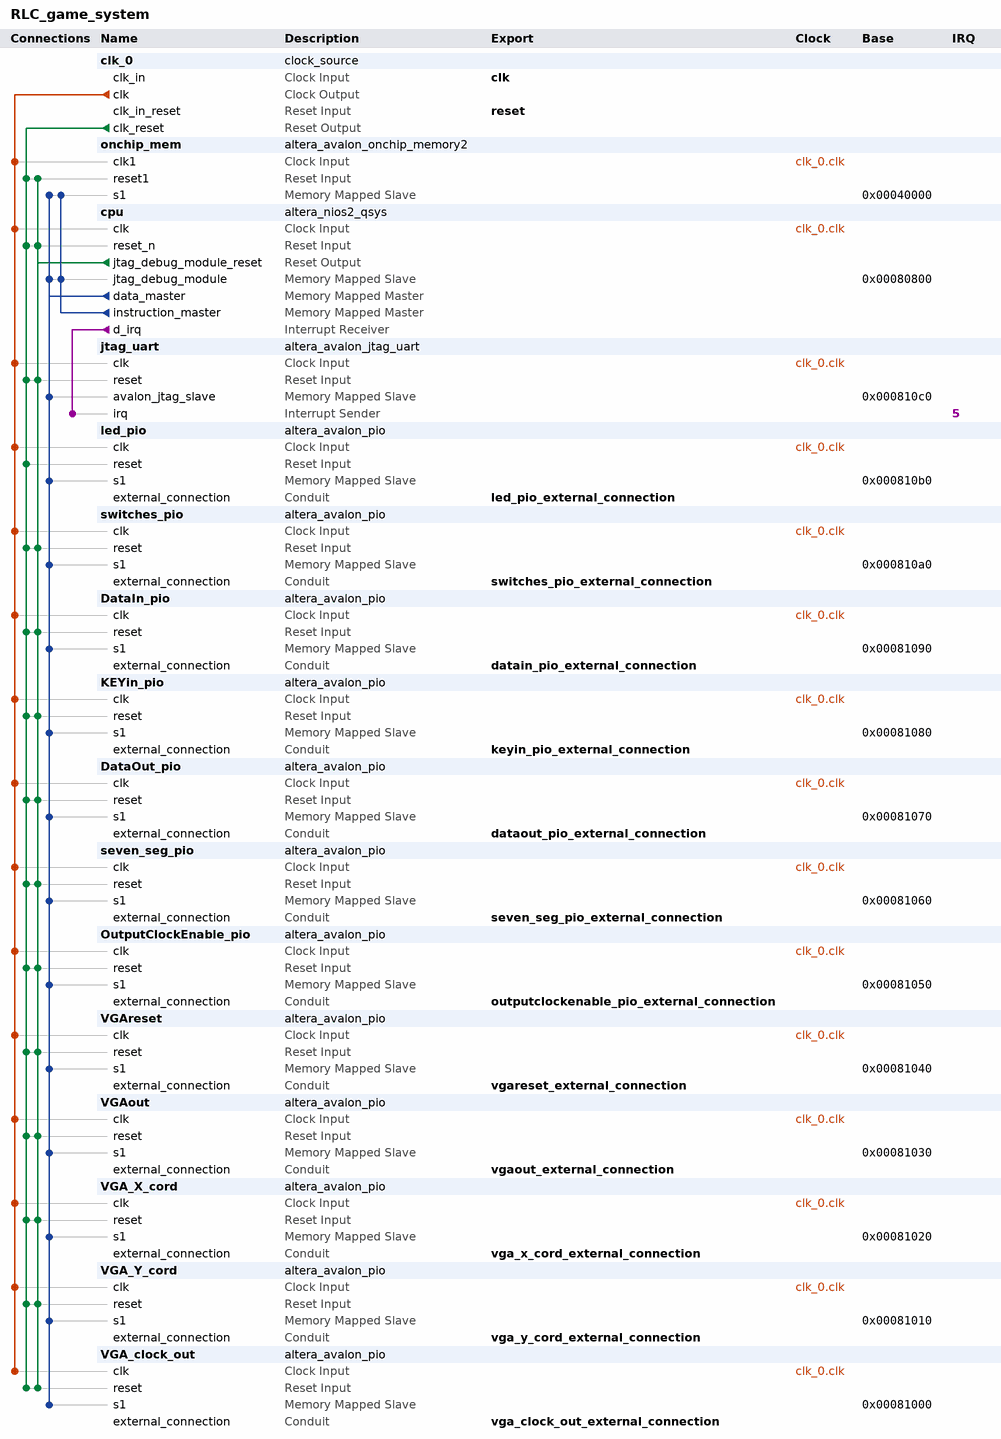
[diagram p0: system contents]
# Platform Designer (Qsys) system RLC_game_system, Cyclone V 5CSEMA5F31C6
# Parameters at their usual value, and those the tool derives, are not listed.
package require -exact qsys 14.0
create_system RLC_game_system
set_project_property DEVICE_FAMILY {Cyclone V}
set_project_property DEVICE 5CSEMA5F31C6

add_instance clk_0 clock_source 14.0
set_instance_parameter_value clk_0 clockFrequency 50000000

add_instance onchip_mem altera_avalon_onchip_memory2 14.0
set_instance_parameter_value onchip_mem dataWidth 32
set_instance_parameter_value onchip_mem dualPort false
set_instance_parameter_value onchip_mem initMemContent true
set_instance_parameter_value onchip_mem initializationFileName onchip_mem.hex
set_instance_parameter_value onchip_mem memorySize 200000

add_instance cpu altera_nios2_qsys 14.0
set_instance_parameter_value cpu resetrequest_enabled true
set_instance_parameter_value cpu resetSlave onchip_mem.s1
set_instance_parameter_value cpu mmu_TLBMissExcSlave None
set_instance_parameter_value cpu exceptionSlave onchip_mem.s1
set_instance_parameter_value cpu breakSlave cpu.jtag_debug_module
set_instance_parameter_value cpu muldiv_multiplierType NoneSmall
set_instance_parameter_value cpu impl Tiny
set_instance_parameter_value cpu icache_size 2048

add_instance jtag_uart altera_avalon_jtag_uart 14.0
set_instance_parameter_value jtag_uart simInteractiveOptions NO_INTERACTIVE_WINDOWS

add_instance led_pio altera_avalon_pio 14.0
set_instance_parameter_value led_pio direction Output
set_instance_parameter_value led_pio width 8

add_instance switches_pio altera_avalon_pio 14.0
set_instance_parameter_value switches_pio direction Input
set_instance_parameter_value switches_pio width 8

add_instance DataIn_pio altera_avalon_pio 14.0
set_instance_parameter_value DataIn_pio direction Input
set_instance_parameter_value DataIn_pio width 8

add_instance KEYin_pio altera_avalon_pio 14.0
set_instance_parameter_value KEYin_pio direction Input
set_instance_parameter_value KEYin_pio width 3

add_instance DataOut_pio altera_avalon_pio 14.0
set_instance_parameter_value DataOut_pio direction Output
set_instance_parameter_value DataOut_pio width 8

add_instance seven_seg_pio altera_avalon_pio 14.0
set_instance_parameter_value seven_seg_pio direction Output
set_instance_parameter_value seven_seg_pio width 7

add_instance OutputClockEnable_pio altera_avalon_pio 14.0
set_instance_parameter_value OutputClockEnable_pio direction Output
set_instance_parameter_value OutputClockEnable_pio width 1

add_instance VGAreset altera_avalon_pio 14.0
set_instance_parameter_value VGAreset direction Output
set_instance_parameter_value VGAreset width 1

add_instance VGAout altera_avalon_pio 14.0
set_instance_parameter_value VGAout direction Output
set_instance_parameter_value VGAout width 24

add_instance VGA_X_cord altera_avalon_pio 14.0
set_instance_parameter_value VGA_X_cord direction Input
set_instance_parameter_value VGA_X_cord width 10

add_instance VGA_Y_cord altera_avalon_pio 14.0
set_instance_parameter_value VGA_Y_cord direction Input
set_instance_parameter_value VGA_Y_cord width 9

add_instance VGA_clock_out altera_avalon_pio 14.0
set_instance_parameter_value VGA_clock_out direction Output
set_instance_parameter_value VGA_clock_out width 1

# connections
add_connection clk_0.clk cpu.clk clock
add_connection clk_0.clk DataIn_pio.clk clock
add_connection clk_0.clk DataOut_pio.clk clock
add_connection clk_0.clk jtag_uart.clk clock
add_connection clk_0.clk KEYin_pio.clk clock
add_connection clk_0.clk led_pio.clk clock
add_connection clk_0.clk onchip_mem.clk1 clock
add_connection clk_0.clk OutputClockEnable_pio.clk clock
add_connection clk_0.clk seven_seg_pio.clk clock
add_connection clk_0.clk switches_pio.clk clock
add_connection clk_0.clk VGA_clock_out.clk clock
add_connection clk_0.clk VGA_X_cord.clk clock
add_connection clk_0.clk VGA_Y_cord.clk clock
add_connection clk_0.clk VGAout.clk clock
add_connection clk_0.clk VGAreset.clk clock
add_connection clk_0.clk_reset cpu.reset_n reset
add_connection clk_0.clk_reset DataIn_pio.reset reset
add_connection clk_0.clk_reset DataOut_pio.reset reset
add_connection clk_0.clk_reset jtag_uart.reset reset
add_connection clk_0.clk_reset KEYin_pio.reset reset
add_connection clk_0.clk_reset led_pio.reset reset
add_connection clk_0.clk_reset onchip_mem.reset1 reset
add_connection clk_0.clk_reset OutputClockEnable_pio.reset reset
add_connection clk_0.clk_reset seven_seg_pio.reset reset
add_connection clk_0.clk_reset switches_pio.reset reset
add_connection clk_0.clk_reset VGA_clock_out.reset reset
add_connection clk_0.clk_reset VGA_X_cord.reset reset
add_connection clk_0.clk_reset VGA_Y_cord.reset reset
add_connection clk_0.clk_reset VGAout.reset reset
add_connection clk_0.clk_reset VGAreset.reset reset
add_connection cpu.jtag_debug_module_reset cpu.reset_n reset
add_connection cpu.jtag_debug_module_reset DataIn_pio.reset reset
add_connection cpu.jtag_debug_module_reset DataOut_pio.reset reset
add_connection cpu.jtag_debug_module_reset jtag_uart.reset reset
add_connection cpu.jtag_debug_module_reset KEYin_pio.reset reset
add_connection cpu.jtag_debug_module_reset onchip_mem.reset1 reset
add_connection cpu.jtag_debug_module_reset OutputClockEnable_pio.reset reset
add_connection cpu.jtag_debug_module_reset seven_seg_pio.reset reset
add_connection cpu.jtag_debug_module_reset switches_pio.reset reset
add_connection cpu.jtag_debug_module_reset VGA_clock_out.reset reset
add_connection cpu.jtag_debug_module_reset VGA_X_cord.reset reset
add_connection cpu.jtag_debug_module_reset VGA_Y_cord.reset reset
add_connection cpu.jtag_debug_module_reset VGAout.reset reset
add_connection cpu.jtag_debug_module_reset VGAreset.reset reset
add_connection cpu.data_master cpu.jtag_debug_module avalon
set_connection_parameter_value cpu.data_master/cpu.jtag_debug_module baseAddress 0x00080800
add_connection cpu.data_master DataIn_pio.s1 avalon
set_connection_parameter_value cpu.data_master/DataIn_pio.s1 baseAddress 0x00081090
add_connection cpu.data_master DataOut_pio.s1 avalon
set_connection_parameter_value cpu.data_master/DataOut_pio.s1 baseAddress 0x00081070
add_connection cpu.data_master jtag_uart.avalon_jtag_slave avalon
set_connection_parameter_value cpu.data_master/jtag_uart.avalon_jtag_slave baseAddress 0x000810c0
add_connection cpu.data_master KEYin_pio.s1 avalon
set_connection_parameter_value cpu.data_master/KEYin_pio.s1 baseAddress 0x00081080
add_connection cpu.data_master led_pio.s1 avalon
set_connection_parameter_value cpu.data_master/led_pio.s1 baseAddress 0x000810b0
add_connection cpu.data_master onchip_mem.s1 avalon
set_connection_parameter_value cpu.data_master/onchip_mem.s1 baseAddress 0x00040000
add_connection cpu.data_master OutputClockEnable_pio.s1 avalon
set_connection_parameter_value cpu.data_master/OutputClockEnable_pio.s1 baseAddress 0x00081050
add_connection cpu.data_master seven_seg_pio.s1 avalon
set_connection_parameter_value cpu.data_master/seven_seg_pio.s1 baseAddress 0x00081060
add_connection cpu.data_master switches_pio.s1 avalon
set_connection_parameter_value cpu.data_master/switches_pio.s1 baseAddress 0x000810a0
add_connection cpu.data_master VGA_clock_out.s1 avalon
set_connection_parameter_value cpu.data_master/VGA_clock_out.s1 baseAddress 0x00081000
add_connection cpu.data_master VGA_X_cord.s1 avalon
set_connection_parameter_value cpu.data_master/VGA_X_cord.s1 baseAddress 0x00081020
add_connection cpu.data_master VGA_Y_cord.s1 avalon
set_connection_parameter_value cpu.data_master/VGA_Y_cord.s1 baseAddress 0x00081010
add_connection cpu.data_master VGAout.s1 avalon
set_connection_parameter_value cpu.data_master/VGAout.s1 baseAddress 0x00081030
add_connection cpu.data_master VGAreset.s1 avalon
set_connection_parameter_value cpu.data_master/VGAreset.s1 baseAddress 0x00081040
add_connection cpu.instruction_master cpu.jtag_debug_module avalon
set_connection_parameter_value cpu.instruction_master/cpu.jtag_debug_module baseAddress 0x00080800
add_connection cpu.instruction_master onchip_mem.s1 avalon
set_connection_parameter_value cpu.instruction_master/onchip_mem.s1 baseAddress 0x00040000
add_connection cpu.d_irq jtag_uart.irq interrupt
set_connection_parameter_value cpu.d_irq/jtag_uart.irq irqNumber 5

# exported interfaces
add_interface clk clock sink
set_interface_property clk EXPORT_OF clk_0.clk_in
add_interface led_pio_external_connection conduit end
set_interface_property led_pio_external_connection EXPORT_OF led_pio.external_connection
add_interface reset reset sink
set_interface_property reset EXPORT_OF clk_0.clk_in_reset
add_interface switches_pio_external_connection conduit end
set_interface_property switches_pio_external_connection EXPORT_OF switches_pio.external_connection
add_interface datain_pio_external_connection conduit end
set_interface_property datain_pio_external_connection EXPORT_OF DataIn_pio.external_connection
add_interface keyin_pio_external_connection conduit end
set_interface_property keyin_pio_external_connection EXPORT_OF KEYin_pio.external_connection
add_interface dataout_pio_external_connection conduit end
set_interface_property dataout_pio_external_connection EXPORT_OF DataOut_pio.external_connection
add_interface seven_seg_pio_external_connection conduit end
set_interface_property seven_seg_pio_external_connection EXPORT_OF seven_seg_pio.external_connection
add_interface outputclockenable_pio_external_connection conduit end
set_interface_property outputclockenable_pio_external_connection EXPORT_OF OutputClockEnable_pio.external_connection
add_interface vgareset_external_connection conduit end
set_interface_property vgareset_external_connection EXPORT_OF VGAreset.external_connection
add_interface vgaout_external_connection conduit end
set_interface_property vgaout_external_connection EXPORT_OF VGAout.external_connection
add_interface vga_x_cord_external_connection conduit end
set_interface_property vga_x_cord_external_connection EXPORT_OF VGA_X_cord.external_connection
add_interface vga_y_cord_external_connection conduit end
set_interface_property vga_y_cord_external_connection EXPORT_OF VGA_Y_cord.external_connection
add_interface vga_clock_out_external_connection conduit end
set_interface_property vga_clock_out_external_connection EXPORT_OF VGA_clock_out.external_connection

set_interconnect_requirement {$system} qsys_mm.clockCrossingAdapter HANDSHAKE
set_interconnect_requirement {$system} qsys_mm.maxAdditionalLatency 1
set_interconnect_requirement {$system} qsys_mm.insertDefaultSlave FALSE

save_system RLC_game_system.qsys
